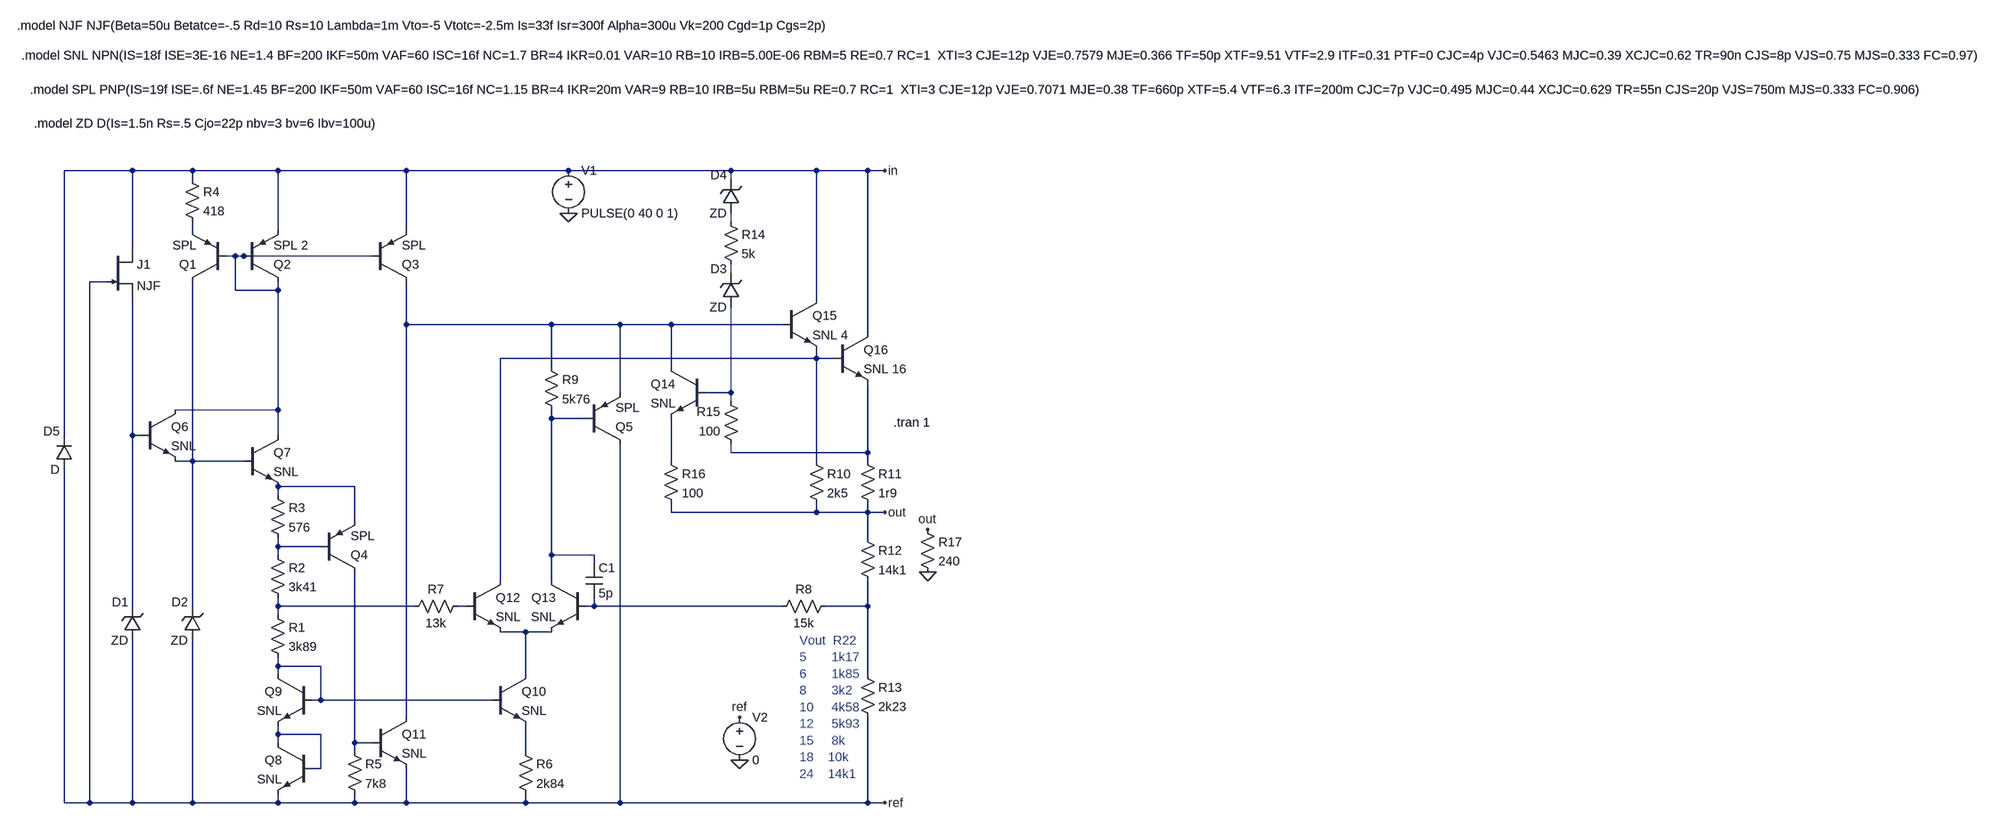
[diagram p0: schematic LM78Lxxtest.asc]
LM78Lxxtest.asc, the LTspice schematic file:
Version 4
SHEET 1 3428 864
WIRE -480 -400 -608 -400
WIRE -368 -400 -480 -400
WIRE -208 -400 -368 -400
WIRE 32 -400 -208 -400
WIRE 336 -400 32 -400
WIRE 640 -400 336 -400
WIRE 800 -400 640 -400
WIRE 896 -400 800 -400
WIRE 928 -400 896 -400
WIRE -368 -384 -368 -400
WIRE 640 -384 640 -400
WIRE 640 -304 640 -320
WIRE -368 -288 -368 -304
WIRE -208 -288 -208 -400
WIRE 32 -288 32 -400
WIRE -480 -256 -480 -400
WIRE -288 -240 -304 -240
WIRE -272 -240 -288 -240
WIRE -32 -240 -272 -240
WIRE 640 -208 640 -224
WIRE -528 -192 -560 -192
WIRE -288 -176 -288 -240
WIRE -208 -176 -208 -192
WIRE -208 -176 -288 -176
WIRE 800 -160 800 -400
WIRE 32 -112 32 -192
WIRE 304 -112 32 -112
WIRE 432 -112 304 -112
WIRE 528 -112 432 -112
WIRE 736 -112 528 -112
WIRE 896 -96 896 -400
WIRE 800 -48 800 -64
WIRE 800 -48 208 -48
WIRE 832 -48 800 -48
WIRE 304 -32 304 -112
WIRE 528 -32 528 -112
WIRE 432 16 432 -112
WIRE 640 16 640 -144
WIRE 640 16 592 16
WIRE 640 32 640 16
WIRE -208 48 -208 -176
WIRE -208 48 -400 48
WIRE 304 64 304 48
WIRE 368 64 304 64
WIRE -608 96 -608 -400
WIRE -480 96 -480 -160
WIRE -464 96 -480 96
WIRE -208 96 -208 48
WIRE 640 128 640 112
WIRE 896 128 896 0
WIRE 896 128 640 128
WIRE -368 144 -368 -192
WIRE -368 144 -400 144
WIRE -272 144 -368 144
WIRE 528 144 528 64
WIRE 800 144 800 -48
WIRE 896 144 896 128
WIRE -64 192 -208 192
WIRE -208 208 -208 192
WIRE 528 240 528 224
WIRE 800 240 800 224
WIRE 800 240 528 240
WIRE 896 240 896 224
WIRE 896 240 800 240
WIRE 928 240 896 240
WIRE -64 256 -64 192
WIRE 896 288 896 240
WIRE -208 304 -208 288
WIRE -128 304 -208 304
WIRE -208 320 -208 304
WIRE 304 320 304 64
WIRE 384 320 304 320
WIRE 384 336 384 320
WIRE 208 368 208 -48
WIRE 304 368 304 320
WIRE -480 416 -480 96
WIRE -368 416 -368 144
WIRE -208 416 -208 400
WIRE 48 416 -208 416
WIRE 144 416 128 416
WIRE 384 416 384 400
WIRE 384 416 368 416
WIRE 736 416 384 416
WIRE 896 416 896 368
WIRE 896 416 816 416
WIRE -208 432 -208 416
WIRE 256 464 208 464
WIRE 304 464 256 464
WIRE -208 528 -208 512
WIRE -128 528 -208 528
WIRE -208 544 -208 528
WIRE 256 544 256 464
WIRE 896 544 896 416
WIRE -128 592 -128 528
WIRE -128 592 -144 592
WIRE 192 592 -128 592
WIRE 32 624 32 -112
WIRE -208 656 -208 640
WIRE -128 656 -208 656
WIRE -208 672 -208 656
WIRE -64 672 -64 352
WIRE -32 672 -64 672
WIRE -64 688 -64 672
WIRE 256 688 256 640
WIRE -128 720 -128 656
WIRE -128 720 -144 720
WIRE -608 784 -608 160
WIRE -560 784 -560 -192
WIRE -560 784 -608 784
WIRE -480 784 -480 480
WIRE -480 784 -560 784
WIRE -368 784 -368 480
WIRE -368 784 -480 784
WIRE -208 784 -208 768
WIRE -208 784 -368 784
WIRE -64 784 -64 768
WIRE -64 784 -208 784
WIRE 32 784 32 720
WIRE 32 784 -64 784
WIRE 256 784 256 768
WIRE 256 784 32 784
WIRE 432 784 432 112
WIRE 432 784 256 784
WIRE 896 784 896 624
WIRE 896 784 432 784
WIRE 928 784 896 784
FLAG 928 240 out
FLAG 928 -400 in
FLAG 928 784 ref
FLAG 336 -320 0
FLAG 656 704 0
FLAG 1008 352 0
FLAG 1008 272 out
FLAG 656 624 ref
SYMBOL res -224 416 R0
SYMATTR InstName R1
SYMATTR Value 3k89
SYMBOL res -224 304 R0
SYMATTR InstName R2
SYMATTR Value 3k41
SYMBOL res -224 192 R0
SYMATTR InstName R3
SYMATTR Value 576
SYMBOL res -384 -400 R0
SYMATTR InstName R4
SYMATTR Value 418
SYMBOL res -80 672 R0
SYMATTR InstName R5
SYMATTR Value 7k8
SYMBOL res 240 672 R0
SYMATTR InstName R6
SYMATTR Value 2k84
SYMBOL res 144 400 R90
WINDOW 0 0 56 VBottom 0
WINDOW 3 32 56 VTop 0
SYMATTR InstName R7
SYMATTR Value 13k
SYMBOL res 832 400 R90
WINDOW 0 0 56 VBottom 0
WINDOW 3 32 56 VTop 0
SYMATTR InstName R8
SYMATTR Value 15k
SYMBOL res 288 -48 R0
SYMATTR InstName R9
SYMATTR Value 5k76
SYMBOL res 784 128 R0
SYMATTR InstName R10
SYMATTR Value 2k5
SYMBOL res 880 128 R0
SYMATTR InstName R11
SYMATTR Value 1r9
SYMBOL res 880 272 R0
SYMATTR InstName R12
SYMATTR Value 14k1
SYMBOL res 880 528 R0
SYMATTR InstName R13
SYMATTR Value 2k23
SYMBOL res 624 -320 R0
SYMATTR InstName R14
SYMATTR Value 5k
SYMBOL res 656 128 R180
WINDOW 0 36 76 Left 0
WINDOW 3 36 40 Left 0
SYMATTR InstName R15
SYMATTR Value 100
SYMBOL zener -464 480 R180
WINDOW 0 24 72 Left 0
WINDOW 3 24 0 Left 0
SYMATTR InstName D1
SYMATTR Value ZD
SYMBOL zener -352 480 R180
WINDOW 0 24 72 Left 0
WINDOW 3 24 0 Left 0
SYMATTR InstName D2
SYMATTR Value ZD
SYMBOL zener 656 -144 R180
WINDOW 0 24 72 Left 0
WINDOW 3 24 0 Left 0
SYMATTR InstName D3
SYMATTR Value ZD
SYMBOL zener 656 -320 R180
WINDOW 0 24 72 Left 0
WINDOW 3 24 0 Left 0
SYMATTR InstName D4
SYMATTR Value ZD
SYMBOL njf -528 -256 R0
SYMATTR InstName J1
SYMBOL pnp -304 -192 R180
SYMATTR InstName Q1
SYMATTR Value SPL
SYMBOL pnp -272 -192 M180
SYMATTR InstName Q2
SYMATTR Value SPL 2
SYMBOL pnp -32 -192 M180
SYMATTR InstName Q3
SYMATTR Value SPL
SYMBOL pnp -128 352 M180
SYMATTR InstName Q4
SYMATTR Value SPL
SYMBOL pnp 368 112 M180
SYMATTR InstName Q5
SYMATTR Value SPL
SYMBOL npn -464 48 R0
SYMATTR InstName Q6
SYMATTR Value SNL
SYMBOL npn -272 96 R0
SYMATTR InstName Q7
SYMATTR Value SNL
SYMBOL npn -144 672 M0
SYMATTR InstName Q8
SYMATTR Value SNL
SYMBOL npn -144 544 M0
SYMATTR InstName Q9
SYMATTR Value SNL
SYMBOL npn 192 544 R0
SYMATTR InstName Q10
SYMATTR Value SNL
SYMBOL npn -32 624 R0
SYMATTR InstName Q11
SYMATTR Value SNL
SYMBOL npn 144 368 R0
SYMATTR InstName Q12
SYMATTR Value SNL
SYMBOL npn 368 368 M0
SYMATTR InstName Q13
SYMATTR Value SNL
SYMBOL npn 592 -32 M0
SYMATTR InstName Q14
SYMATTR Value SNL
SYMBOL npn 736 -160 R0
SYMATTR InstName Q15
SYMATTR Value SNL 4
SYMBOL npn 832 -96 R0
SYMATTR InstName Q16
SYMATTR Value SNL 16
SYMBOL cap 368 336 R0
SYMATTR InstName C1
SYMATTR Value 5p
SYMBOL res 512 128 R0
SYMATTR InstName R16
SYMATTR Value 100
SYMBOL voltage 336 -416 R0
WINDOW 123 0 0 Left 0
WINDOW 39 0 0 Left 0
SYMATTR InstName V1
SYMATTR Value PULSE(0 40 0 1)
SYMBOL res 992 256 R0
SYMATTR InstName R17
SYMATTR Value 240
SYMBOL voltage 656 608 R0
WINDOW 123 0 0 Left 0
WINDOW 39 0 0 Left 0
SYMATTR InstName V2
SYMATTR Value 0
SYMBOL diode -592 160 R180
WINDOW 0 24 72 Left 0
WINDOW 3 24 0 Left 0
SYMATTR InstName D5
TEXT 944 72 Left 0 !.tran 1
TEXT -696 -672 Left 0 !.model NJF NJF(Beta=50u Betatce=-.5 Rd=10 Rs=10 Lambda=1m Vto=-5 Vtotc=-2.5m Is=33f Isr=300f Alpha=300u Vk=200 Cgd=1p Cgs=2p)
TEXT -688 -616 Left 0 !.model SNL NPN(IS=18f ISE=3E-16 NE=1.4 BF=200 IKF=50m VAF=60 ISC=16f NC=1.7 BR=4 IKR=0.01 VAR=10 RB=10 IRB=5.00E-06 RBM=5 RE=0.7 RC=1  XTI=3 CJE=12p VJE=0.7579 MJE=0.366 TF=50p XTF=9.51 VTF=2.9 ITF=0.31 PTF=0 CJC=4p VJC=0.5463 MJC=0.39 XCJC=0.62 TR=90n CJS=8p VJS=0.75 MJS=0.333 FC=0.97)
TEXT -672 -552 Left 0 !.model SPL PNP(IS=19f ISE=.6f NE=1.45 BF=200 IKF=50m VAF=60 ISC=16f NC=1.15 BR=4 IKR=20m VAR=9 RB=10 IRB=5u RBM=5u RE=0.7 RC=1  XTI=3 CJE=12p VJE=0.7071 MJE=0.38 TF=660p XTF=5.4 VTF=6.3 ITF=200m CJC=7p VJC=0.495 MJC=0.44 XCJC=0.629 TR=55n CJS=20p VJS=750m MJS=0.333 FC=0.906)
TEXT -664 -488 Left 0 !.model ZD D(Is=1.5n Rs=.5 Cjo=22p nbv=3 bv=6 Ibv=100u)
TEXT 768 480 Left 0 ;Vout  R22\n5       1k17\n6       1k85\n8       3k2\n10     4k58\n12     5k93 \n15     8k\n18    10k\n24    14k1

The netlist it stands for:
* LM78Lxxtest.asc
R1 N015 N020 3k89
R2 N014 N015 3k41
R3 N013 N014 576
R4 in N002 418
R5 N022 ref 7k8
R6 N023 ref 2k84
R7 N016 N015 13k
R8 N018 N017 15k
R9 N005 N008 5k76
R10 N006 out 2k5
R11 N010 out 1r9
R12 out N018 14k1
R13 N018 ref 2k23
R14 N001 N004 5k
R15 N010 N007 100
D1 ref N009 ZD
D2 ref N011 ZD
D3 N007 N004 ZD
D4 N001 in ZD
J1 in ref N009 NJF
Q1 N011 N003 N002 0 SPL
Q2 N003 N003 in 0 SPL 2
Q3 N005 N003 in 0 SPL
Q4 N022 N014 N013 0 SPL
Q5 ref N008 N005 0 SPL
Q6 N003 N009 N011 0 SNL
Q7 N003 N011 N013 0 SNL
Q8 N021 N021 ref 0 SNL
Q9 N020 N020 N021 0 SNL
Q10 N019 N020 N023 0 SNL
Q11 N005 N022 ref 0 SNL
Q12 N006 N016 N019 0 SNL
Q13 N008 N017 N019 0 SNL
Q14 N005 N007 N012 0 SNL
Q15 in N005 N006 0 SNL 4
Q16 in N006 N010 0 SNL 16
C1 N008 N017 5p
R16 N012 out 100
V1 in 0 PULSE(0 40 0 1)
R17 out 0 240
V2 ref 0 0
D5 ref in D
.model D D
.lib standard.dio
.model NPN NPN
.model PNP PNP
.lib standard.bjt
.model NJF NJF
.model PJF PJF
.lib standard.jft
.tran 1
.model NJF NJF(Beta=50u Betatce=-.5 Rd=10 Rs=10 Lambda=1m Vto=-5 Vtotc=-2.5m Is=33f Isr=300f Alpha=300u Vk=200 Cgd=1p Cgs=2p)
.model SNL NPN(IS=18f ISE=3E-16 NE=1.4 BF=200 IKF=50m VAF=60 ISC=16f NC=1.7 BR=4 IKR=0.01 VAR=10 RB=10 IRB=5.00E-06 RBM=5 RE=0.7 RC=1  XTI=3 CJE=12p VJE=0.7579 MJE=0.366 TF=50p XTF=9.51 VTF=2.9 ITF=0.31 PTF=0 CJC=4p VJC=0.5463 MJC=0.39 XCJC=0.62 TR=90n CJS=8p VJS=0.75 MJS=0.333 FC=0.97)
.model SPL PNP(IS=19f ISE=.6f NE=1.45 BF=200 IKF=50m VAF=60 ISC=16f NC=1.15 BR=4 IKR=20m VAR=9 RB=10 IRB=5u RBM=5u RE=0.7 RC=1  XTI=3 CJE=12p VJE=0.7071 MJE=0.38 TF=660p XTF=5.4 VTF=6.3 ITF=200m CJC=7p VJC=0.495 MJC=0.44 XCJC=0.629 TR=55n CJS=20p VJS=750m MJS=0.333 FC=0.906)
.model ZD D(Is=1.5n Rs=.5 Cjo=22p nbv=3 bv=6 Ibv=100u)
* Vout  R22
* 5       1k17
* 6       1k85
* 8       3k2
* 10     4k58
* 12     5k93
* 15     8k
* 18    10k
* 24    14k1
.backanno
.end